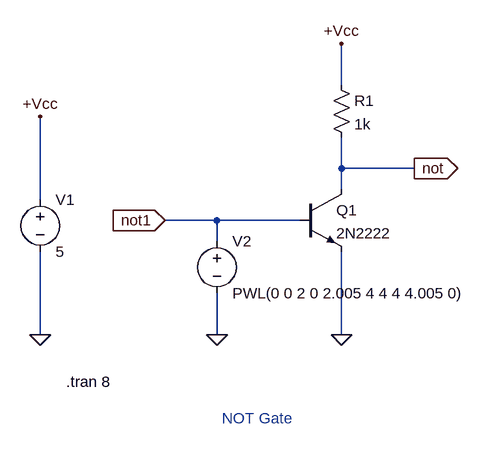
[diagram p0: schematic NOT gate.asc]
NOT gate.asc, the LTspice schematic file:
Version 4
SHEET 1 880 680
WIRE 480 -80 480 -144
WIRE 480 48 480 0
WIRE 592 48 480 48
WIRE 480 80 480 48
WIRE 16 96 16 -32
WIRE 288 128 208 128
WIRE 416 128 288 128
WIRE 288 160 288 128
WIRE 16 304 16 176
WIRE 288 304 288 240
WIRE 480 304 480 176
FLAG 480 304 0
FLAG 288 304 0
FLAG 16 304 0
FLAG 16 -32 +Vcc
FLAG 480 -144 +Vcc
FLAG 208 128 not1
IOPIN 208 128 In
FLAG 592 48 not
IOPIN 592 48 Out
SYMBOL voltage 16 80 R0
SYMATTR InstName V1
SYMATTR Value 5
SYMBOL npn 416 80 R0
SYMATTR InstName Q1
SYMATTR Value 2N2222
SYMBOL res 464 -96 R0
SYMATTR InstName R1
SYMATTR Value 1k
SYMBOL voltage 288 144 R0
WINDOW 123 0 0 Left 0
WINDOW 39 0 0 Left 0
SYMATTR InstName V2
SYMATTR Value PWL(0 0 2 0 2.005 4 4 4 4.005 0)
TEXT 56 376 Left 2 !.tran 8
TEXT 296 432 Left 2 ;NOT Gate

The netlist it stands for:
* NOT gate.asc
V1 +Vcc 0 5
Q1 not not1 0 0 2N2222
R1 +Vcc not 1k
V2 not1 0 PWL(0 0 2 0 2.005 4 4 4 4.005 0)
.model NPN NPN
.model PNP PNP
.lib standard.bjt
.tran 8
* NOT Gate
.backanno
.end